# Altium schematic sheet fpga_power.SchDoc: Spartan-6 FPGA Power
size A; Engineer: A. Peck; Organization: UCLA High Energy Physics; DocumentNumber: 6; Revision: 3.0; SheetNumber: 6; SheetTotal: 15; Project: LCT Comparator Tester
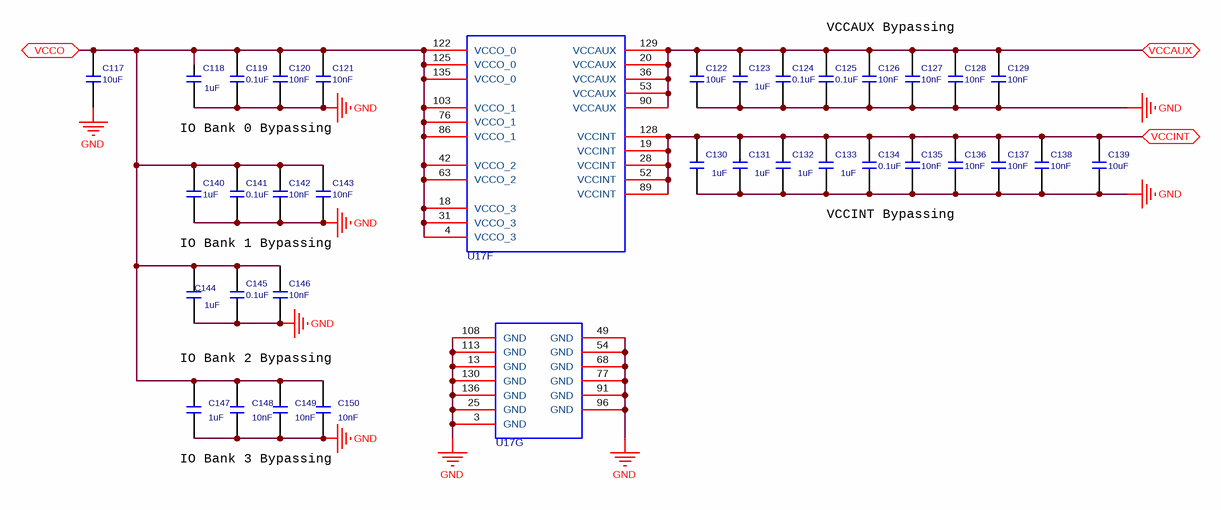
[diagram p0: fpga_power.SchDoc]

## Parts
C117  10uF  [c1206]
C118  1uF  [C0603]
C119  0.1uF  [C0603]
C120  10nF  [C0603]
C121  10nF  [C0603]
C122  10uF  [c1206]
C123  1uF  [C0603]
C124  0.1uF  [C0603]
C125  0.1uF  [C0603]
C126  10nF  [C0603]
C127  10nF  [C0603]
C128  10nF  [C0603]
C129  10nF  [C0603]
C130  1uF  [C0603]
C131  1uF  [C0603]
C132  1uF  [C0603]
C133  1uF  [C0603]
C134  0.1uF  [C0603]
C135  10nF  [C0603]
C136  10nF  [C0603]
C137  10nF  [C0603]
C138  10nF  [C0603]
C139  10uF  [c1206]
C140  1uF  [C0603]
C141  0.1uF  [C0603]
C142  10nF  [C0603]
C143  10nF  [C0603]
C144  1uF  [C0603]
C145  0.1uF  [C0603]
C146  10nF  [C0603]
C147  1uF  [C0603]
C148  10nF  [C0603]
C149  10nF  [C0603]
C150  10nF  [C0603]
U17  XC6SLX4-2TQG144C  [TQFP-144]  (value not drawn)  (parts F,G of 7)

## Ports
VCCAUX, VCCINT, VCCO

## Nets
GND: C117.1 C118.2 C119.1 C120.1 C121.1 C122.1 C123.2 C124.1 C125.1 C126.1 C127.1 C128.1 C129.1 C130.2 C131.2 C132.2 C133.2 C134.2 C135.1 C136.1 C137.1 C138.1 C139.1 C140.2 C141.1 C142.1 C143.1 C144.2 C145.1 C146.1 C147.2 C148.1 C149.1 C150.1 U17.3(GND) U17.13(GND) U17.25(GND) U17.49(GND) U17.54(GND) U17.68(GND) U17.77(GND) U17.91(GND) U17.96(GND) U17.108(GND) U17.113(GND) U17.130(GND) U17.136(GND)
VCCAUX: C122.2 C123.1 C124.2 C125.2 C126.2 C127.2 C128.2 C129.2 U17.20(VCCAUX) U17.36(VCCAUX) U17.53(VCCAUX) U17.90(VCCAUX) U17.129(VCCAUX) ; port VCCAUX
VCCINT: C130.1 C131.1 C132.1 C133.1 C134.1 C135.2 C136.2 C137.2 C138.2 C139.2 U17.19(VCCINT) U17.28(VCCINT) U17.52(VCCINT) U17.89(VCCINT) U17.128(VCCINT) ; port VCCINT
VCCO: C117.2 C118.1 C119.2 C120.2 C121.2 C140.1 C141.2 C142.2 C143.2 C144.1 C145.2 C146.2 C147.1 C148.2 C149.2 C150.2 U17.4(VCCO_3) U17.18(VCCO_3) U17.31(VCCO_3) U17.42(VCCO_2) U17.63(VCCO_2) U17.76(VCCO_1) U17.86(VCCO_1) U17.103(VCCO_1) U17.122(VCCO_0) U17.125(VCCO_0) U17.135(VCCO_0) ; port VCCO

## Notes on the sheet
- VCCAUX Bypassing
- IO Bank 0 Bypassing
- VCCINT Bypassing
- IO Bank 1 Bypassing
- IO Bank 2 Bypassing
- IO Bank 3 Bypassing
- Date:
- Rev:
- of
- Sheet

## Library data of the parts
C117 C122 C139 = CAP/GMK316F106ZL-T: CAP-CER, 2, 10uF, 10%, 35V, 1206; Manufacturer: Taiyo Yuden; Capacitance: 10µF; Tolerance: -20%, +80%; Temperature Coefficient: Y5V (F); Supplier 1: Digi-Key; Manufacturer Part Number: GMK316F106ZL-T; RoHS: RoHS Compliant; Category: Capacitors; Stock 1: 249989; Pricing 1: 1=0.46, 10=0.345, 50=0.2012, 100=0.161, 250=0.115, 500=0.0782, 1000=0.06325 (USD); Packaging: Cut Tape (CT); Voltage - Rated: 35V; Mounting Type: Surface Mount, MLCC; Operating Temperature: -30°C ~ 85°C; Applications: General Purpose; Ratings: -; Package / Case: 1206 (3216 Metric); Size / Dimension: 0.126" L x 0.063" W (3.20mm x 1.60mm); Height - Seated (Max): -; Thickness (Max): 0.071" (1.80mm); Lead Spacing: -; Features: -; Lead Style: -; ComponentLink1URL: http://ds.yuden.co.jp/TYCOMPAS/ut/detail.do?productNo=GMK316F106ZL-T&fileName=GMK316F106ZL-T_SS&mode=specSheetDownload; ComponentLink1Description: http://ds.yuden.co.jp/TYCOMPAS/ut/detail.do?productNo=GMK316F106ZL-T&fileName=GMK316F106ZL-T_SS&mode=specSheetDownload; Supplier Part Number 1: 587-1352-1-ND
C118 C123 C130-C133 C140 C144 C147 = Murata/GRM188R61E105KA12D: CAP-CER, 2, 1.0uF, 10%, 25V, 0603; Manufacturer: Murata Electronics North America; Capacitance: 1µF; Temperature Coefficient: X5R; Supplier 1: Digi-Key; Manufacturer Part Number: GRM188R61E105KA12D; RoHS: RoHS Compliant; Category: Capacitors; Packaging: Cut Tape (CT); Tolerance: ±10%; Voltage - Rated: 25V; Mounting Type: Surface Mount, MLCC; Operating Temperature: -55°C ~ 85°C; Package / Case: 0603 (1608 Metric); Size / Dimension: 0.063" L x 0.031" W (1.60mm x 0.80mm); Height - Seated (Max): -; Lead Spacing: -; Features: -; ComponentLink1URL: http://www.murata.com/~/media/webrenewal/support/library/catalog/products/capacitor/mlcc/c02e.pdf; ComponentLink1Description: http://www.murata.com/~/media/webrenewal/support/library/catalog/products/capacitor/mlcc/c02e.pdf; Supplier Part Number 1: 490-3897-1-ND; Stock 1: 1899119; Pricing 1: 1=0.1, 10=0.036, 50=0.0196, 100=0.0165, 250=0.01352, 500=0.01156, 1000=0.009 (USD); Applications: General Purpose; Ratings: -; Thickness (Max): 0.035" (0.90mm); Lead Style: -
C119 C124 C125 C134 C141 C145 = CAP/06035C104KAT2A: CAP-CER, 2, 0.1uF, 10%, 50V, 0603, X7R; Manufacturer: AVX Corporation; Capacitance: 0.10µF; Supplier 1: Digi-Key; Supplier Part Number 1: 478-5052-1-ND; Manufacturer Part Number: 06035C104KAT2A; RoHS: RoHS Compliant; Category: Capacitors; Stock 1: 4412408; Pricing 1: 1=0.1, 10=0.036, 25=0.0264, 50=0.0198, 100=0.0162, 250=0.01352, 500=0.01156, 1000=0.00908 (USD); Packaging: Cut Tape (CT); Tolerance: ±10%; Voltage - Rated: 50V; Temperature Coefficient: X7R; Mounting Type: Surface Mount, MLCC; Operating Temperature: -55°C ~ 125°C; Applications: General Purpose; Ratings: -; Package / Case: 0603 (1608 Metric); Size / Dimension: 0.063" L x 0.032" W (1.60mm x 0.81mm); Height - Seated (Max): -; Thickness (Max): 0.035" (0.90mm); Lead Spacing: -; Features: -; Lead Style: -; ComponentLink1URL: http://datasheets.avx.com/X7RDielectric.pdf; ComponentLink1Description: http://datasheets.avx.com/X7RDielectric.pdf; Supplier 2: Newark; Supplier Part Number 2: 54K2412
C120 C121 C126-C129 C135-C138 C142 C143 C146 C148-C150 = CAP/GRM188R71H103KA01D: CAP-CER, 2, 0.01uF, 10%, 50V, X7R, 0603; Manufacturer: Murata Electronics North America; Capacitance: 10000pF; Supplier 1: Digi-Key; Manufacturer Part Number: GRM188R71H103KA01D; RoHS: RoHS Compliant; Category: Capacitors; Stock 1: 3035311; Pricing 1: 1=0.1, 10=0.019, 50=0.01, 100=0.0085, 250=0.00696, 500=0.00596, 1000=0.00465 (USD); Packaging: Cut Tape (CT); Tolerance: ±10%; Voltage - Rated: 50V; Temperature Coefficient: X7R; Mounting Type: Surface Mount, MLCC; Operating Temperature: -55°C ~ 125°C; Applications: General Purpose; Ratings: -; Package / Case: 0603 (1608 Metric); Size / Dimension: 0.063" L x 0.031" W (1.60mm x 0.80mm); Height - Seated (Max): -; Thickness (Max): 0.035" (0.90mm); Lead Spacing: -; Features: -; Lead Style: -; ComponentLink1URL: http://www.murata.com/~/media/webrenewal/support/library/catalog/products/capacitor/mlcc/c02e.pdf; ComponentLink1Description: http://www.murata.com/~/media/webrenewal/support/library/catalog/products/capacitor/mlcc/c02e.pdf; Supplier Part Number 1: 490-1512-1-ND; Supplier 2: Newark; Supplier Part Number 2: 38K1669
U17 = Xilinx/FPGA-XSP6-XC6SLX9-SQ144: FPGA, Spartan-6 LX 1.2V, 102 User I/Os, 144-Pin TQFP (0.5mm Pitch), Speed Grade 2, Commercial Grade, Pb-Free; PackageReference: TQG144; Code_JEDEC: MS-026-BFB; DatasheetVersion: ver1.6, Nov-2010; PackageVersion: ver1.2, Jun-2004; PackageDescription: 144-Pin Thin Quad Flat Pack (TQG144) - Pb-Free; Supplier 1: Digi-Key; Supplier Part Number 1: 122-1734-ND